# EAGLE schematic mq3Circuit (EAGLE 9.6.2)
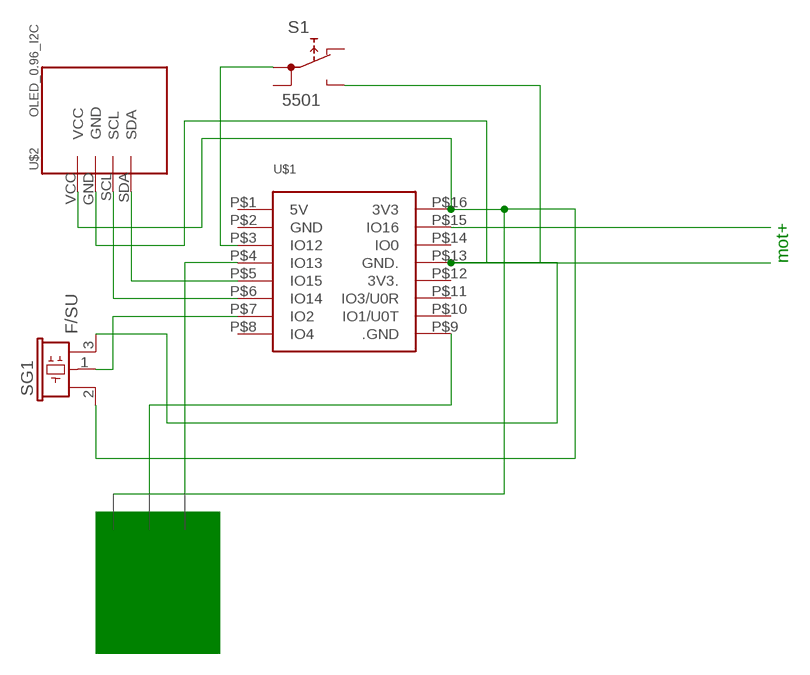
[diagram p0: schematic, sheet 1]

## Parts
S1  5501  [5501]
SG1  F/SU  [F/SU]
U$1  ESP32-CAM  [ESP32-CAM]
U$2  OLED_0.96_I2C  [OLED_0.96_I2C]

## Nets
N$1: SG1.1 U$1.P$7(IO2)
N$2: S1.NO SG1.3 U$1.P$13(GND.) U$2.GND
N$3: U$1.P$5(IO15) U$2.SDA
N$4: U$1.P$6(IO14) U$2.SCL
N$5: SG1.2 U$1.P$16(3V3) U$2.VCC
N$6: U$1.P$4(IO13)
N$8: S1.1A U$1.P$3(IO12)
N$9: U$1.P$9(.GND)
N$10: U$1.P$15(IO16)
Unconnected: S1.1B S1.NC U$1.P$1(5V) U$1.P$2(GND) U$1.P$8(IO4) U$1.P$10(IO1/U0T) U$1.P$11(IO3/U0R) U$1.P$12(3V3.) U$1.P$14(IO0)

## Notes on the sheet
- mot+
- VCC | GND | A0
- MQ-3

## Library data of the parts
S1 = switch:55?: PUSHBUTTON SERIES 5500 SWITCHES Source: www.e-switch.com .. 5500.pdf
SG1 = buzzer:F/SU: BUZZER Source: Spoerle
U$1 = ESP32-CAM:ESP32-CAM: Check availability <https://pricing.snapeda.com/parts/ESP32-CAM/AI-Thinker/view-part?ref=eda>; AVAILABILITY: Not in stock; DESCRIPTION: ESP32 ESP32 Transceiver; 802.11 a/b/g/n (Wi-Fi, WiFi, WLAN), Bluetooth® Smart 4.x Low Energy (BLE) Evaluation Board; MF: AI-Thinker; MP: ESP32-CAM; PACKAGE: None; PRICE: None
U$2 = tft_1_8_1_44_oled_0_96:OLED_0.96_I2C